# EAGLE design tiny84RGB (EAGLE 6.3)
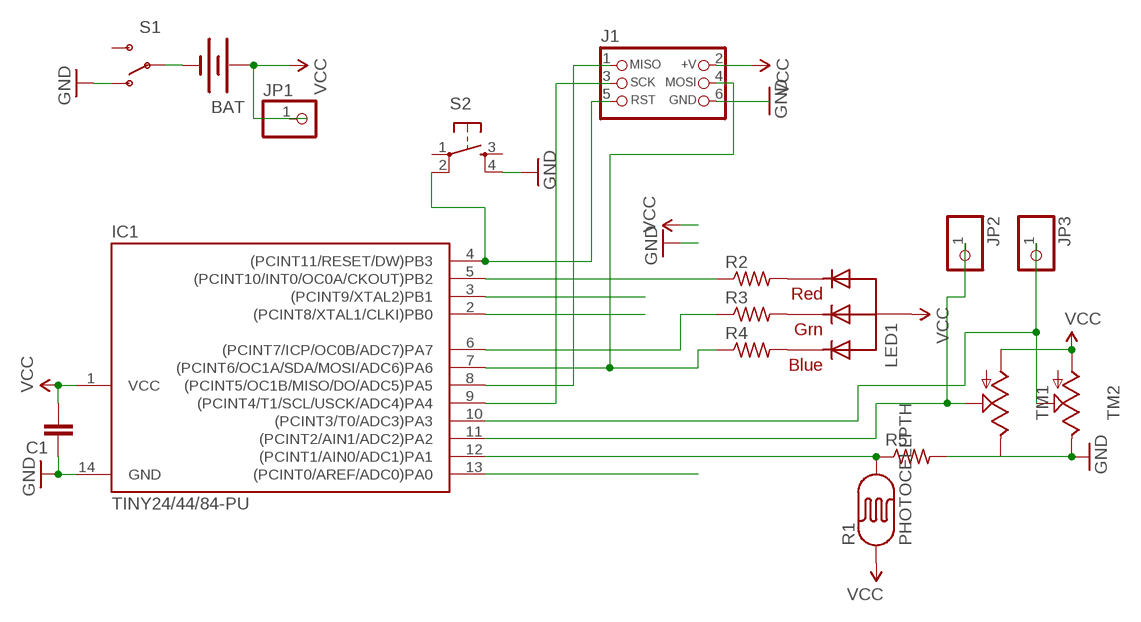
[diagram p0: schematic, sheet 1]

## Parts
BAT  BATTERY20PTH  [BATTCOM_20MM_PTH]
C1  CAPKIT  [CAP-PTH-SMALL-KIT]
IC1  TINY24/44/84-PU  [DIL14]
J1  CON_HEADER_PRG_AVR_ICSP-PTH  [HEADER_PRG_2X03]
JP1  PINHD-1X1CB  [1X01-CLEANBIG]
JP2  PINHD-1X1CB  [1X01-CLEANBIG]
JP3  PINHD-1X1CB  [1X01-CLEANBIG]
LED1  RGBLED_CA-5MM  [LED5MMRGB]
R1  PHOTOCELLPTH  [PHOTOCELL]
R2  R-US_0204/7  [0204/7]
R3  R-US_0204/7  [0204/7]
R4  R-US_0204/7  [0204/7]
R5  R-US_0204/7  [0204/7]
S1  SWITCH-SPSTPTH  [SWITCH-SPDT]
S2  TAC_SWITCHPTH  [TACTILE-PTH]
TM1  TRIM  [6MM]
TM2  TRIM  [6MM]

## Nets
D0: IC1.13((PCINT0/AREF/ADC0)PA0)
D1: IC1.12((PCINT1/AIN0/ADC1)PA1) R1.2 R5.1
D2: IC1.11((PCINT2/AIN1/ADC2)PA2) JP2.1 TM1.S
D3: IC1.10((PCINT3/T0/ADC3)PA3) JP3.1 TM2.S
D4: IC1.9((PCINT4/T1/SCL/USCK/ADC4)PA4) J1.3(SCK)
D5: IC1.8((PCINT5/OC1B/MISO/DO/ADC5)PA5) J1.1(MISO)
D6: IC1.7((PCINT6/OC1A/SDA/MOSI/ADC6)PA6) J1.4(MOSI) R4.1
D7: IC1.6((PCINT7/ICP/OC0B/ADC7)PA7) R3.1
D9: IC1.3((PCINT9/XTAL2)PB1)
D10: IC1.2((PCINT8/XTAL1/CLKI)PB0)
GND: C1.1 IC1.14(GND) R5.2 S1.1(O) S2.4 TM1.E TM2.E
N$1: BAT.2(-) S1.2(P)
N$2: J1.6(GND)
N$3: LED1.1(RED) R2.2
N$4: LED1.3(GREEN) R3.2
N$5: LED1.4(BLUE) R4.2
N$6: IC1.5((PCINT10/INT0/OC0A/CKOUT)PB2) R2.1
RESET: IC1.4((PCINT11/RESET/DW)PB3) J1.5(RST) S2.2
VCC: BAT.1(+) C1.2 IC1.1(VCC) J1.2(+V) JP1.1 LED1.2(VCC) R1.1 TM1.A TM2.A
Unconnected: S1.3(S) S2.1 S2.3

## Library data of the parts
BAT = SparkFun_mod:BATTERY: Battery Holders Various common sizes : AA, AAA, 20mm coin cell and 12mm coin cell.
C1 = SparkFun:CAP: Capacitor Standard 0603 ceramic capacitor, and 0.1" leaded capacitor.
IC1 = avr-7:TINY24/44/84
J1 = dp_devices:CON_HEADER_PRG_AVR_ICSP: 2x3 AVR ICSP programming header
JP1-JP3 = adafruit:PINHD-1X1: Pin header 1x1 for 0.1" spacing With round pins
LED1 = adafruit:RGBLED_CA: RGB LED, common-anode 5MM Staggered pins 5mm Piranha package http://www.ladyada.net/library/pcb/eaglelibrary.html
R1 = SparkFun:PHOTOCELL: Photocell Also known as a CdS photoresistor. This is a low cost way to detect light levels. Resistance decreases with more incoming light. SparkFun SKU: SEN-09088
R2-R5 = adafruit:R-US_: RESISTOR, American symbol
S1 = SparkFun:SWITCH-SPST: SPST Switch Simple slide switch. Spark Fun Electronics SKU : COM-00102
S2 = SparkFun:TAC_SWITCH: Momentary Switch Button commonly used for reset or general input. Spark Fun Electronics SKU : COM-00097
TM1 TM2 = adafruit:TRIM

## Board
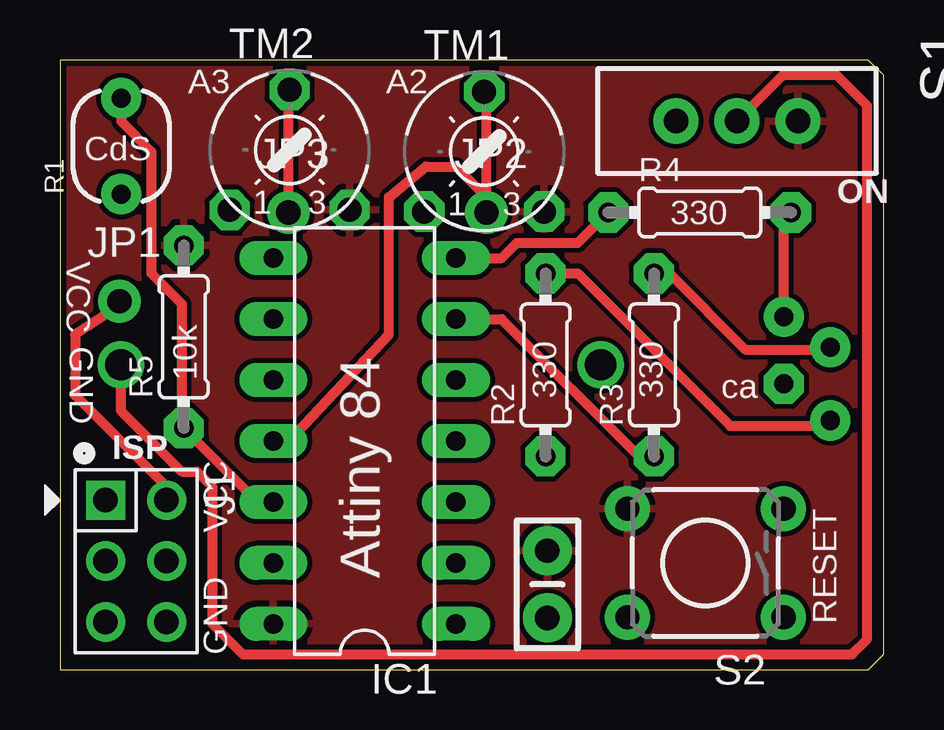
[diagram p1: board, top side]
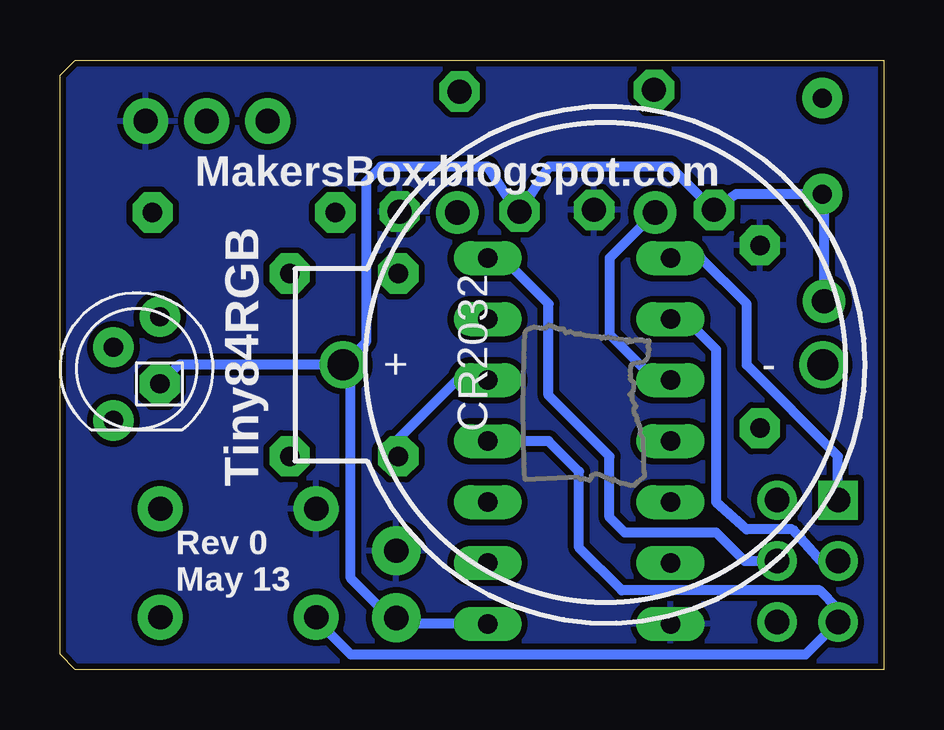
[diagram p2: board, bottom side, seen from below]

Size 34.34 x 25.4 mm. Coordinates in mm from the lower left corner, seen from the top.
Outline: 33.71,0 33.71,0 34.34,0.64 34.34,24.77 33.7,25.4 32.7,25.4 28.57,25.4 27.94,25.4 0,25.4 0,0 33.71,0
Copper layers (1*16): Top 0.035mm / dielectric 1.5mm / Bottom 0.035mm
Design rules "SparkFun": minimum track width 8mil, minimum drill 20mil, track to track 8mil, track to pad 8mil, pad to pad 8mil, via to via 8mil, smd to smd 8mil, copper to edge 10mil, drill to drill 8mil, minimum pad ring 12mil, minimum via ring 10mil, stop-mask expansion 4mil, vias tented up to drill 25mil, thermal gap 10mil

### Footprints (pad centres in the part's own frame; a part is rotated, then mirrored left to right if it is on the bottom)
BATTCOM_20MM_PTH = drill 1.3: 1 20,0; 2 0,0
CAP-PTH-SMALL-KIT = drill 1.016 pad 2.032: 1 -1.397,0; 2 1.397,0
DIL14 = drill 0.813 long: 1 -7.62,-3.81; 2 -5.08,-3.81; 3 -2.54,-3.81; 4 0,-3.81; 5 2.54,-3.81; 6 5.08,-3.81; 7 7.62,-3.81; 8 7.62,3.81; 9 5.08,3.81; 10 2.54,3.81; 11 0,3.81; 12 -2.54,3.81; 13 -5.08,3.81; 14 -7.62,3.81
HEADER_PRG_2X03 = drill 1.02 pad 1.632 square: 1 -2.54,-1.27 | drill 1.02 pad 1.632: 2 -2.54,1.27; 3 0,-1.27; 4 0,1.27; 5 2.54,-1.27; 6 2.54,1.27
1X01-CLEANBIG = drill 1.016 pad 1.778: 1 0,0
LED5MMRGB = drill 0.8 pad 1.676: 1 -2.159,0.968; 3 0.889,0.968; 4 2.159,-0.968 | drill 0.8 pad 1.676 octagon: 2 -0.635,-0.968
PHOTOCELL = drill 0.8 pad 1.676: 1 -2,0; 2 2,0
0204/7 = drill 0.813 pad 1.676 octagon: 1 -3.81,0; 2 3.81,0
SWITCH-SPDT = drill 1.016 pad 1.88: 1 0,2.54; 2 0,0; 3 0,-2.54
TACTILE-PTH = drill 1.016 pad 1.88: 1 -3.251,2.261; 2 3.251,2.261; 3 -3.251,-2.261; 4 3.251,-2.261
6MM = drill 1 pad 1.676 octagon: A -2.5,-2.5; E 2.5,-2.5; S 0,2.5

### Placement (x,y rotation side)
BAT  2.54,12.7 0 top
C1  20.32,3.56 270 top
IC1  12.7,9.53 90 top
J1  3.17,4.53 270 top
JP1  2.48,15.35 0 top
JP2  17.78,19.05 0 top
JP3  9.53,19.05 0 top
LED1  31.14,12.54 90 bottom
R1  2.56,21.82 90 top
R2  20.24,12.7 90 top
R3  24.77,12.7 90 top
R4  26.67,19.05 0 top
R5  5.16,13.87 90 top
S1  28.23,22.86 270 top
S2  26.91,4.45 180 top
TM1  17.68,21.59 0 top
TM2  9.57,21.65 0 top
U$1  [OREGON_18_52]  9.78,13.72 90 top

### Tracks (layer width: path | path; a pad name or v marks a point on that pad's centre or on a via)
D1
  Top 0.406: IC1.12 8.23,6.99 R5.1 5.08,10.14 5.08,15.24 3.81,16.51 3.81,21.59 2.56,22.84 R1.2
D2
  Top 0.406: JP2.1 17.78,19.68 | 17.78,19.68 17.78,24 TM1.S | IC1.11 9.53,9.53 13.72,13.97 13.72,19.68 15.24,20.95 16.51,20.95 17.78,19.68
D3
  Top 0.406: JP3.1 9.53,23.86 TM2.S
  Bottom 0.406: JP3.1 11.43,17.14 11.43,13.97 9.53,12.06 IC1.10
D4
  Bottom 0.406: J1.3 2.62,4.53 3.81,5.84 5.71,5.84 6.99,6.99 6.99,13.34 8.26,14.61 IC1.9
D5
  Bottom 0.406: J1.1 1.91,8.89 5.71,12.7 5.71,15.24 7.62,17.14 IC1.8
D6
  Top 0.406: IC1.7 18.41,17.14 19.05,17.78 21.59,17.78 R4.1
  Bottom 0.406: J1.4 5.79,4.53 6.99,5.71 10.79,5.71 11.43,6.35 11.43,8.89 13.97,11.43 13.97,15.24 15.88,17.14 IC1.7
D7
  Top 0.406: IC1.6 18.41,14.61 24.13,8.89 R3.1
GND
  pour Bottom (isolate 0.254): -30.48,26.67 44.67,25.67 44.67,-2.27 -30.48,-1.27
  pour Top: -29.84,26.04 43.67,25.04 43.67,-1 26.04,-0.64 -29.84,-0.64
N$1
  Top 0.406: BAT.2 2.54,10.79 5.08,8.26 5.71,8.26 6.35,7.62 6.35,1.91 7.62,0.64 33.02,0.64 33.66,1.27 33.66,23.5 32.38,24.77 30.13,24.77 S1.2
N$3
  Top 0.406: R2.2 21.59,16.51 27.94,10.16 31.89,10.16 LED1.1
N$4
  Top 0.406: R3.2 25.4,16.51 28.57,13.34 32.02,13.34 LED1.3
N$5
  Top 0.406: LED1.4 30.18,18.75 R4.2
N$6
  Bottom 0.406: IC1.5 17.78,12.06 20.32,9.53 20.32,8.97 R2.1
RESET
  Bottom 0.406: IC1.4 13.97,9.53 12.7,8.26 12.7,5.08 10.92,3.3 2.67,3.3 1.91,2.54 J1.5 3.25,0.64 22.23,0.64 23.39,1.8 S2.2
VCC
  Top 0.406: JP1.1 2.48,15.18 0.64,13.97 0.64,11.43 4.45,7.62 J1.2
  Bottom 0.406: IC1.1 20.07,1.91 C1.2 20.57,2.16 22.23,3.81 22.23,12.38 BAT.1 | BAT.1 29.38,12.7 LED1.2 | JP1.1 2.48,19.74 R1.1 6.16,19.82 TM2.A 7.07,19.14 8.89,20.95 13.96,20.95 TM1.A 15.28,19.09 16.51,20.95 20.95,20.95 21.59,20.32 21.59,13.65 BAT.1

### Text on the board
tPlace: A3 | A2 | CdS | 330 | ON | VCC | GND | 10k | 330 | 330 | ca | ISP | VCC | Attiny 84 | RESET | GND
bPlace: MakersBox.blogspot.com | Tiny84RGB | Rev 0 / May 13